# EAGLE design catch_sensor (EAGLE 9.6.2)
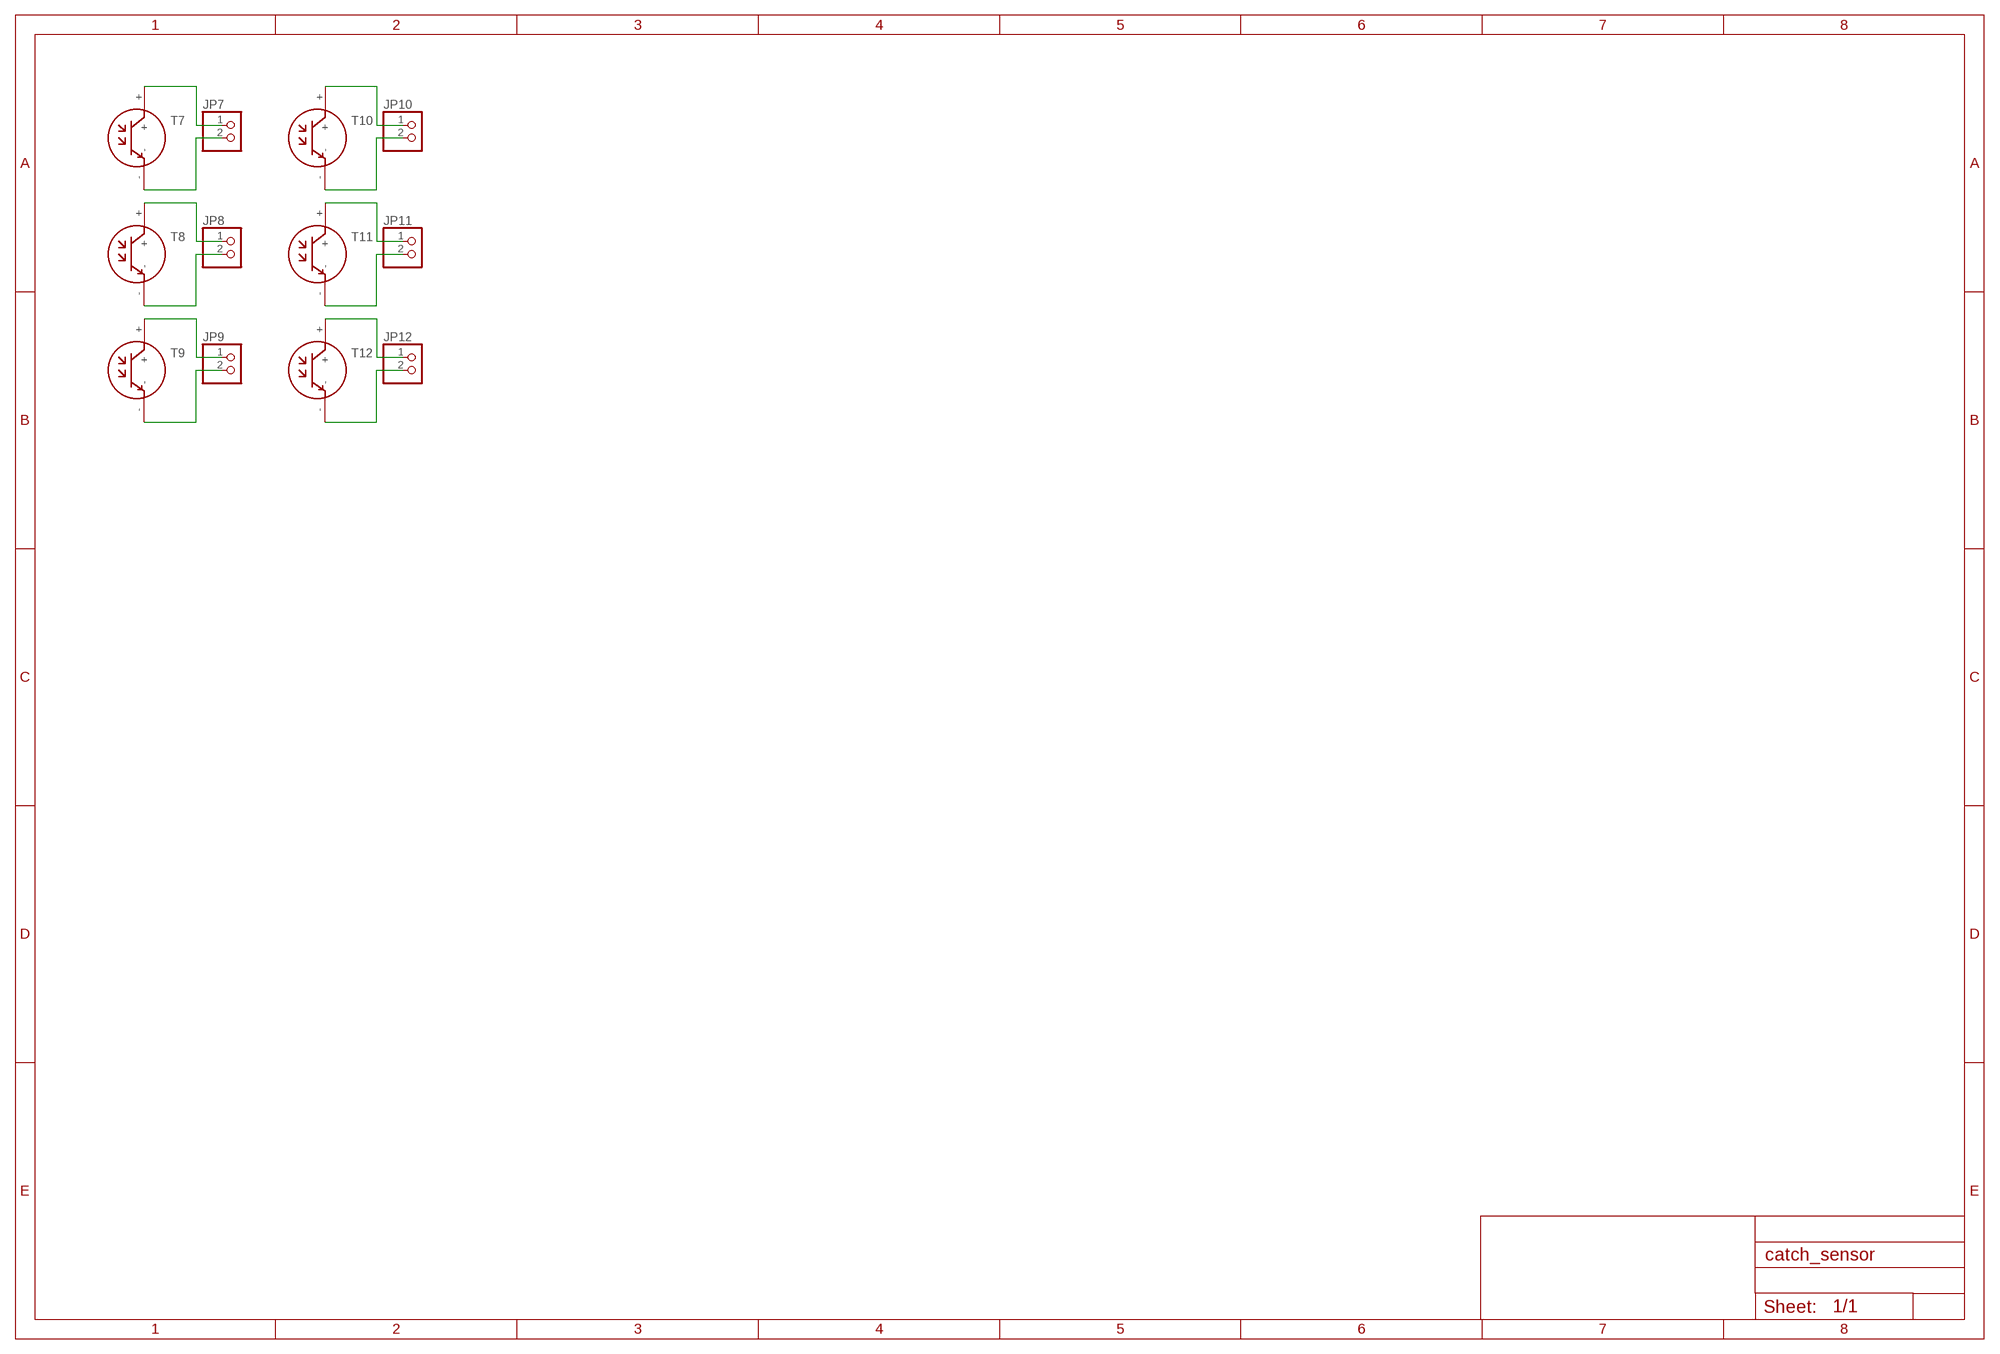
[diagram p0: schematic, sheet 1]

## Parts
JP7  PINHD-1X2  [1X02]
JP8  PINHD-1X2  [1X02]
JP9  PINHD-1X2  [1X02]
JP10  PINHD-1X2  [1X02]
JP11  PINHD-1X2  [1X02]
JP12  PINHD-1X2  [1X02]
T7  NJL7302L-F3  [NJL7302L-F3]
T8  NJL7302L-F3  [NJL7302L-F3]
T9  NJL7302L-F3  [NJL7302L-F3]
T10  NJL7302L-F3  [NJL7302L-F3]
T11  NJL7302L-F3  [NJL7302L-F3]
T12  NJL7302L-F3  [NJL7302L-F3]

## Nets
N$13: JP7.1 T7.+
N$14: JP7.2 T7.-
N$15: JP8.1 T8.+
N$16: JP8.2 T8.-
N$17: JP9.1 T9.+
N$18: JP9.2 T9.-
N$19: JP10.1 T10.+
N$20: JP10.2 T10.-
N$21: JP11.1 T11.+
N$22: JP11.2 T11.-
N$23: JP12.1 T12.+
N$24: JP12.2 T12.-

## Library data of the parts
JP7-JP12 = pinhead:PINHD-1X2: PIN HEADER
T7-T12 = NJL7302L-F3:NJL7302L-F3

## Board
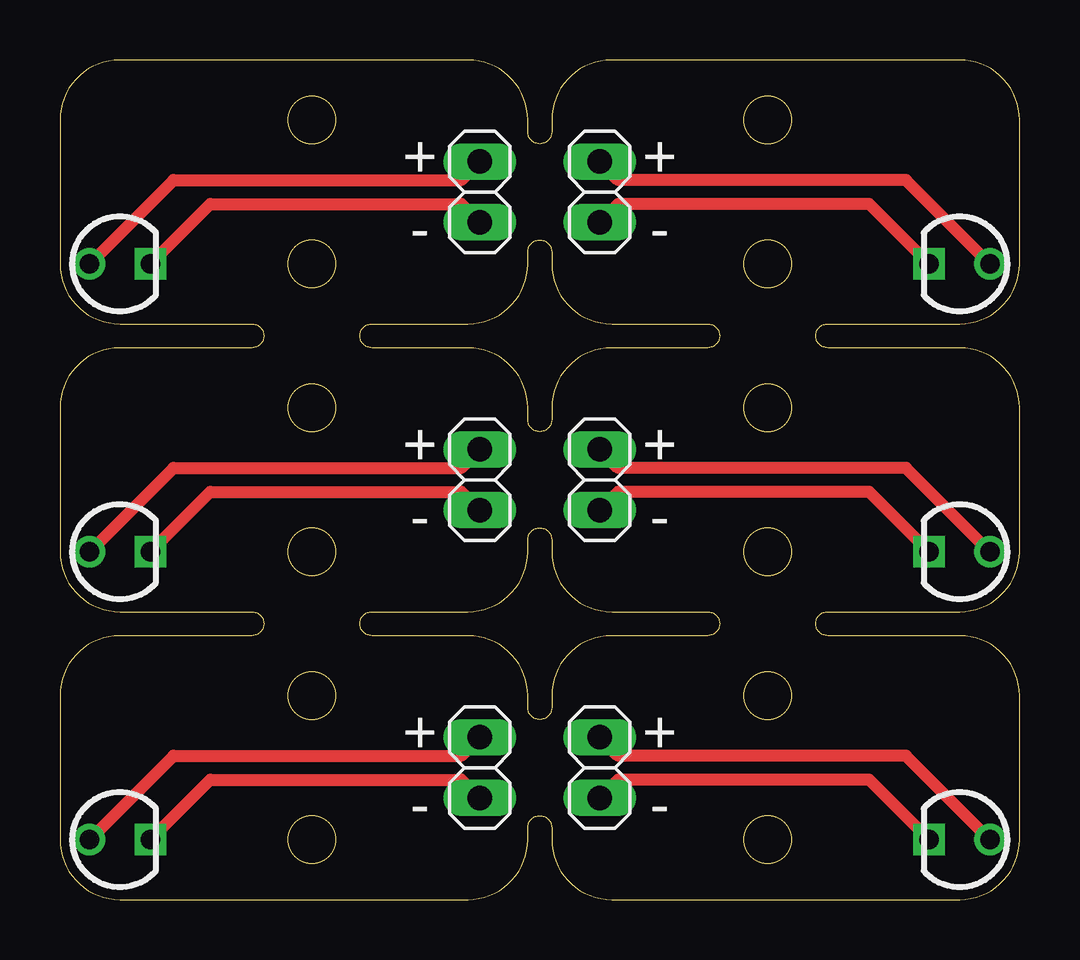
[diagram p1: board, top side]

Size 40 x 35 mm. Coordinates in mm from the lower left corner, seen from the top.
Outline: 32,24 37.5,24 arc90 40,26.5 40,32.5 arc90 37.5,35 23,35 arc90 20.5,32.5 20.5,32 arc-180 19.5,32 19.5,32.5 arc90 17,35 2.5,35 arc90 0,32.5 0,26.5 arc90 2.5,24 8,24 arc-180 8,23 2.5,23 arc90 0,20.5 0,14.5 arc90 2.5,12 8,12 arc-180 8,11 2.5,11 arc90 0,8.5 0,2.5 arc90 2.5,0 17,0 arc90 19.5,2.5 19.5,3 arc-180 20.5,3 20.5,2.5 arc90 23,0 37.5,0 arc90 40,2.5 40,8.5 arc90 37.5,11 32,11 arc-180 32,12 37.5,12 arc90 40,14.5 40,20.5 arc90 37.5,23 32,23 arc-180 32,24
Outline: 27,11 23,11 arc90 20.5,8.5 20.5,8 arc-180 19.5,8 19.5,8.5 arc90 17,11 13,11 arc-180 13,12 17,12 arc90 19.5,14.5 19.5,15 arc-180 20.5,15 20.5,14.5 arc90 23,12 27,12 arc-180 27,11
Outline: 27,23 23,23 arc90 20.5,20.5 20.5,20 arc-180 19.5,20 19.5,20.5 arc90 17,23 13,23 arc-180 13,24 17,24 arc90 19.5,26.5 19.5,27 arc-180 20.5,27 20.5,26.5 arc90 23,24 27,24 arc-180 27,23
Outline: circle at 29.5,32.5 radius 1
Outline: circle at 29.5,26.5 radius 1
Outline: circle at 10.5,26.5 radius 1
Outline: circle at 10.5,32.5 radius 1
Outline: circle at 10.5,20.5 radius 1
Outline: circle at 10.5,14.5 radius 1
Outline: circle at 29.5,14.5 radius 1
Outline: circle at 29.5,20.5 radius 1
Outline: circle at 10.5,8.5 radius 1
Outline: circle at 10.5,2.5 radius 1
Outline: circle at 29.5,2.5 radius 1
Outline: circle at 29.5,8.5 radius 1
Copper layers (1*16): Top 0.035mm / dielectric 1.5mm / Bottom 0.035mm
Design rules "default *": minimum track width 6mil, minimum drill 0.35mm, track to track 6mil, track to pad 6mil, pad to pad 6mil, via to via 6mil, smd to smd 6mil, copper to edge 30mil, drill to drill 6mil, minimum pad ring 10mil, minimum via ring 8mil, stop-mask expansion 4mil, vias tented up to drill 0mil, thermal gap 10mil

### Footprints (pad centres in the part's own frame; a part is rotated, then mirrored left to right if it is on the bottom)
1X02 = drill 1.016 long: 1 -1.27,0; 2 1.27,0
NJL7302L-F3 = drill 0.8: + 1.27,0 | drill 0.8 square: - -1.27,0

### Placement (x,y rotation side)
JP7  17.5,29.5 270 top
JP8  17.5,17.5 270 top
JP9  17.5,5.5 270 top
JP10  22.5,29.5 270 top
JP11  22.5,17.5 270 top
JP12  22.5,5.5 270 top
T7  2.5,26.5 180 top
T8  2.5,14.5 180 top
T9  2.5,2.5 180 top
T10  37.5,26.5 0 top
T11  37.5,14.5 0 top
T12  37.5,2.5 0 top

### Tracks (layer width: path | path; a pad name or v marks a point on that pad's centre or on a via)
N$13
  Top 0.5: T7.+ 4.73,30 16.73,30 JP7.1
N$14
  Top 0.5: T7.- 6.27,29 16.73,29 JP7.2
N$15
  Top 0.5: T8.+ 4.73,18 16.73,18 JP8.1
N$16
  Top 0.5: T8.- 6.27,17 16.73,17 JP8.2
N$17
  Top 0.5: T9.+ 4.73,6 16.73,6 JP9.1
N$18
  Top 0.5: T9.- 6.27,5 16.73,5 JP9.2
N$19
  Top 0.5: T10.+ 35.27,30 23.27,30 JP10.1
N$20
  Top 0.5: T10.- 33.73,29 23.27,29 JP10.2
N$21
  Top 0.5: T11.+ 35.27,18 23.27,18 JP11.1
N$22
  Top 0.5: T11.- 33.73,17 23.27,17 JP11.2
N$23
  Top 0.5: T12.+ 35.27,6 23.27,6 JP12.1
N$24
  Top 0.5: T12.- 33.73,5 23.27,5 JP12.2

### Text on the board
tPlace: + | + | - | - | + | + | - | - | + | + | - | -